# EAGLE design Main circuit SMD (EAGLE 9.4.2)
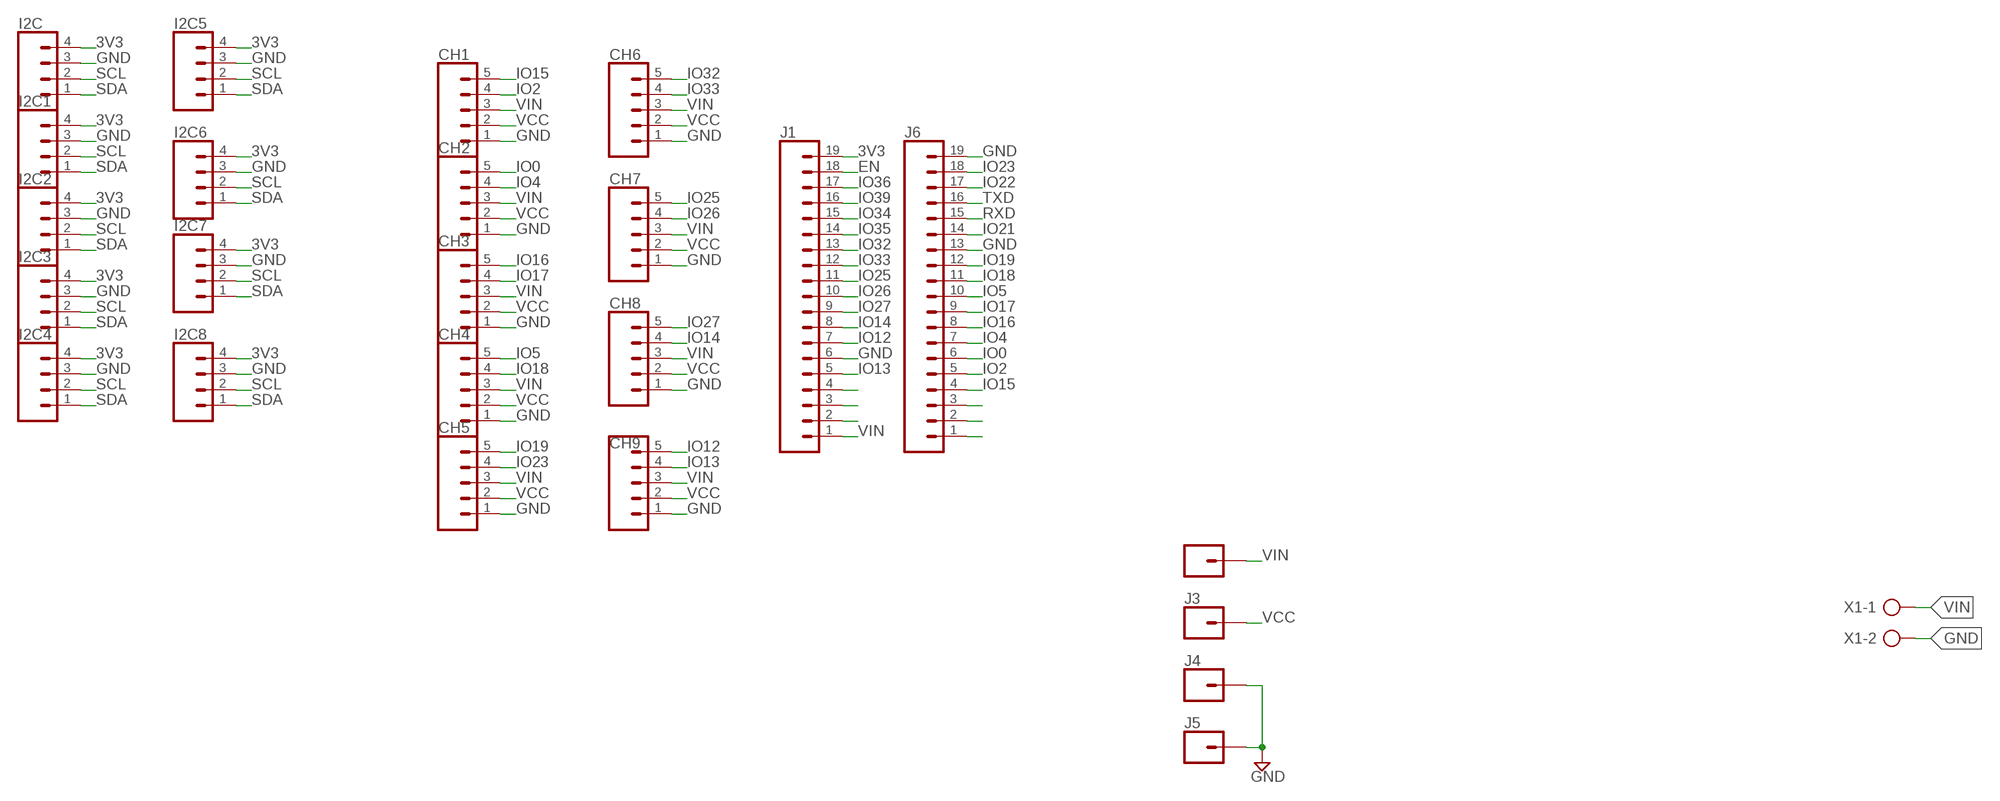
[diagram p0: schematic, sheet 1]

## Parts
CH1  CONN_05  [1X05]
CH2  CONN_05  [1X05]
CH3  CONN_05  [1X05]
CH4  CONN_05  [1X05]
CH5  CONN_05  [1X05]
CH6  CONN_05  [1X05]
CH7  CONN_05  [1X05]
CH8  CONN_05  [1X05]
CH9  CONN_05  [1X05]
I2C  CONN_04  [1X04]
I2C1  CONN_04  [1X04]
I2C2  CONN_04  [1X04]
I2C3  CONN_04  [1X04]
I2C4  CONN_04  [1X04]
I2C5  CONN_04  [1X04]
I2C6  CONN_04  [1X04]
I2C7  CONN_04  [1X04]
I2C8  CONN_04  [1X04]
J1  CONN_19  [1X19]
J2  CONN_01  [1X01]
J3  CONN_01  [1X01]
J4  CONN_01  [1X01]
J5  CONN_01  [1X01]
J6  CONN_19  [1X19]
X1  AK500/2-H  [AK500/2-H]

## Nets
3V3: I2C1.4 I2C2.4 I2C3.4 I2C4.4 I2C5.4 I2C6.4 I2C7.4 I2C8.4 I2C.4 J1.19
EN: J1.18
GND: CH1.1 CH2.1 CH3.1 CH4.1 CH5.1 CH6.1 CH7.1 CH8.1 CH9.1 I2C1.3 I2C2.3 I2C3.3 I2C4.3 I2C5.3 I2C6.3 I2C7.3 I2C8.3 I2C.3 J1.6 J4.1 J5.1 J6.13 J6.19 X1.2
IO0: CH2.5 J6.6
IO2: CH1.4 J6.5
IO4: CH2.4 J6.7
IO5: CH4.5 J6.10
IO12: CH9.5 J1.7
IO13: CH9.4 J1.5
IO14: CH8.4 J1.8
IO15: CH1.5 J6.4
IO16: CH3.5 J6.8
IO17: CH3.4 J6.9
IO18: CH4.4 J6.11
IO19: CH5.5 J6.12
IO21: J6.14
IO22: J6.17
IO23: CH5.4 J6.18
IO25: CH7.5 J1.11
IO26: CH7.4 J1.10
IO27: CH8.5 J1.9
IO32: CH6.5 J1.13
IO33: CH6.4 J1.12
IO34: J1.15
IO35: J1.14
IO36: J1.17
IO39: J1.16
N$18: J1.4
N$19: J1.3
N$20: J1.2
N$22: J6.1
N$23: J6.2
N$24: J6.3
RXD: J6.15
SCL: I2C1.2 I2C2.2 I2C3.2 I2C4.2 I2C5.2 I2C6.2 I2C7.2 I2C8.2 I2C.2
SDA: I2C1.1 I2C2.1 I2C3.1 I2C4.1 I2C5.1 I2C6.1 I2C7.1 I2C8.1 I2C.1
TXD: J6.16
VCC: CH1.2 CH2.2 CH3.2 CH4.2 CH5.2 CH6.2 CH7.2 CH8.2 CH9.2 J3.1
VIN: CH1.3 CH2.3 CH3.3 CH4.3 CH5.3 CH6.3 CH7.3 CH8.3 CH9.3 J1.1 J2.1 X1.1

## Library data of the parts
CH1-CH9 = SparkFun-Connectors:CONN_05: Multi connection point. Often used as Generic Header-pin footprint for 0.1 inch spaced/style header connections On any of the 0.1 inch spaced packages, you can populate with these: Break Away Headers - Straight <https://www.sparkfun.com/products/116> (PRT-00116) Break Away Male Headers - Right Angle <https://www.sparkfun.com/products/553> (PRT-00553) Female Headers <https://www.sparkfun.com/products/115> (PRT-00115) Break Away Headers - Machine Pin <https://www.sparkfun.com/products/117> (PRT-00117) Break Away Female Headers - Swiss Machine Pin <https://www.sparkfun.com/products/743> (PRT-00743) For SCREWTERMINALS and SPRING TERMINALS visit here: Screw Terimnals on SparkFun.com <https://www.sparkfun.com/search/results?term=Screw+Terminals> (5mm/3.5mm/2.54mm spacing) This device is also useful as a general connection point to wire up your design to another part of your project. Our various solder wires solder well into these plated through hole pads. Hook-Up Wire - Assortment (Stranded, 22 AWG) <https://www.sparkfun.com/products/11375> (PRT-11375) Hook-Up Wire - Assortment (Solid Core, 22 AWG) <https://www.sparkfun.com/products/11367> (PRT-11367) View the entire wire category on our website here <https://www.sparkfun.com/categories/141> Special notes: Molex polarized connector foot print use with SKU : PRT-08231 with associated crimp pins and housings. 1MM SMD Version SKU: PRT-10208
I2C I2C1-I2C8 = SparkFun-Connectors:CONN_04: Multi connection point. Often used as Generic Header-pin footprint for 0.1 inch spaced/style header connections On any of the 0.1 inch spaced packages, you can populate with these: Break Away Headers - Straight <https://www.sparkfun.com/products/116> (PRT-00116) Break Away Male Headers - Right Angle <https://www.sparkfun.com/products/553> (PRT-00553) Female Headers <https://www.sparkfun.com/products/115> (PRT-00115) Break Away Headers - Machine Pin <https://www.sparkfun.com/products/117> (PRT-00117) Break Away Female Headers - Swiss Machine Pin <https://www.sparkfun.com/products/743> (PRT-00743) For SCREWTERMINALS and SPRING TERMINALS visit here: Screw Terimnals on SparkFun.com <https://www.sparkfun.com/search/results?term=Screw+Terminals> (5mm/3.5mm/2.54mm spacing) This device is also useful as a general connection point to wire up your design to another part of your project. Our various solder wires solder well into these plated through hole pads. Hook-Up Wire - Assortment (Stranded, 22 AWG) <https://www.sparkfun.com/products/11375> (PRT-11375) Hook-Up Wire - Assortment (Solid Core, 22 AWG) <https://www.sparkfun.com/products/11367> (PRT-11367) View the entire wire category on our website here <https://www.sparkfun.com/categories/141> Special notes: Molex polarized connector foot print use with SKU : PRT-08231 with associated crimp pins and housings. 1MM SMD Version SKU: PRT-10208; PROD_ID: CONN-09696
J1 J6 = SparkFun-Connectors:CONN_19: Multi connection point. Often used as Generic Header-pin footprint for 0.1 inch spaced/style header connections On any of the 0.1 inch spaced packages, you can populate with these: Break Away Headers - Straight <https://www.sparkfun.com/products/116> (PRT-00116) Break Away Male Headers - Right Angle <https://www.sparkfun.com/products/553> (PRT-00553) Female Headers <https://www.sparkfun.com/products/115> (PRT-00115) Break Away Headers - Machine Pin <https://www.sparkfun.com/products/117> (PRT-00117) Break Away Female Headers - Swiss Machine Pin <https://www.sparkfun.com/products/743> (PRT-00743) For SCREWTERMINALS and SPRING TERMINALS visit here: Screw Terimnals on SparkFun.com <https://www.sparkfun.com/search/results?term=Screw+Terminals> (5mm/3.5mm/2.54mm spacing) This device is also useful as a general connection point to wire up your design to another part of your project. Our various solder wires solder well into these plated through hole pads. Hook-Up Wire - Assortment (Stranded, 22 AWG) <https://www.sparkfun.com/products/11375> (PRT-11375) Hook-Up Wire - Assortment (Solid Core, 22 AWG) <https://www.sparkfun.com/products/11367> (PRT-11367) View the entire wire category on our website here <https://www.sparkfun.com/categories/141> Special notes: Molex polarized connector foot print use with SKU : PRT-08231 with associated crimp pins and housings. 1MM SMD Version SKU: PRT-10208 NOTES ON THE VARIANTS LOCK and LOCK_LONGPADS... This footprint was designed to help hold the alignment of a through-hole component (i.e. 6-pin header) while soldering it into place. You may notice that each hole has been shifted either up or down by 0.005 of an inch from it's more standard position (which is a perfectly straight line). This slight alteration caused the pins (the squares in the middle) to touch the edges of the holes. Because they are alternating, it causes a "brace" to hold the component in place. 0.005 has proven to be the perfect amount of "off-center" position when using our standard breakaway headers. Although looks a little odd when you look at the bare footprint, once you have a header in there, the alteration is very hard to notice. Also,if you push a header all the way into place, it is covered up entirely on the bottom side.
J2-J5 = SparkFun-Connectors:CONN_01: Single connection point. Often used as Generic Header-pin footprint for 0.1 inch spaced/style header connections On any of the 0.1 inch spaced packages, you can populate with these: Break Away Headers - Straight <https://www.sparkfun.com/products/116> (PRT-00116) Break Away Male Headers - Right Angle <https://www.sparkfun.com/products/553> (PRT-00553) Female Headers <https://www.sparkfun.com/products/115> (PRT-00115) Break Away Headers - Machine Pin <https://www.sparkfun.com/products/117> (PRT-00117) Break Away Female Headers - Swiss Machine Pin <https://www.sparkfun.com/products/743> (PRT-00743) This device is also useful as a general connection point to wire up your design to another part of your project. Our various solder wires solder well into these plated through hole pads. Hook-Up Wire - Assortment (Stranded, 22 AWG) <https://www.sparkfun.com/products/11375> (PRT-11375) Hook-Up Wire - Assortment (Solid Core, 22 AWG) <https://www.sparkfun.com/products/11367> (PRT-11367) View the entire wire category on our website here <https://www.sparkfun.com/categories/141> Special notes: SMTSO-256-ET is a "flush mount" nut for a 4-40 screw. We mostly use this on specialty testbeds; it is a nice way to connect hardware to your PCB at an adjustable hieght. Also note, the SNAP packages are for using a snappable style connector. We sell a baggie of snaps and they are also used on two LilyPad designs: Snap Assortment - 30 pack (male and female) <https://www.sparkfun.com/products/11347> (DEV-11347) LilyPad Arduino SimpleSnap <https://www.sparkfun.com/products/10941> (DEV-10941) LilyPad SimpleSnap Protoboard <https://www.sparkfun.com/products/10940> (DEV-10940)
X1 = con-ptr500:AK500/2-H: CONNECTOR Aug. 2004 / PTR Meßtechnik: Die Bezeichnung der Serie AK505 wurde geändert. Es handelt sich hierbei um AK500 in horizontaler Ausführung.; OC_FARNELL: unknown; OC_NEWARK: unknown

## Board
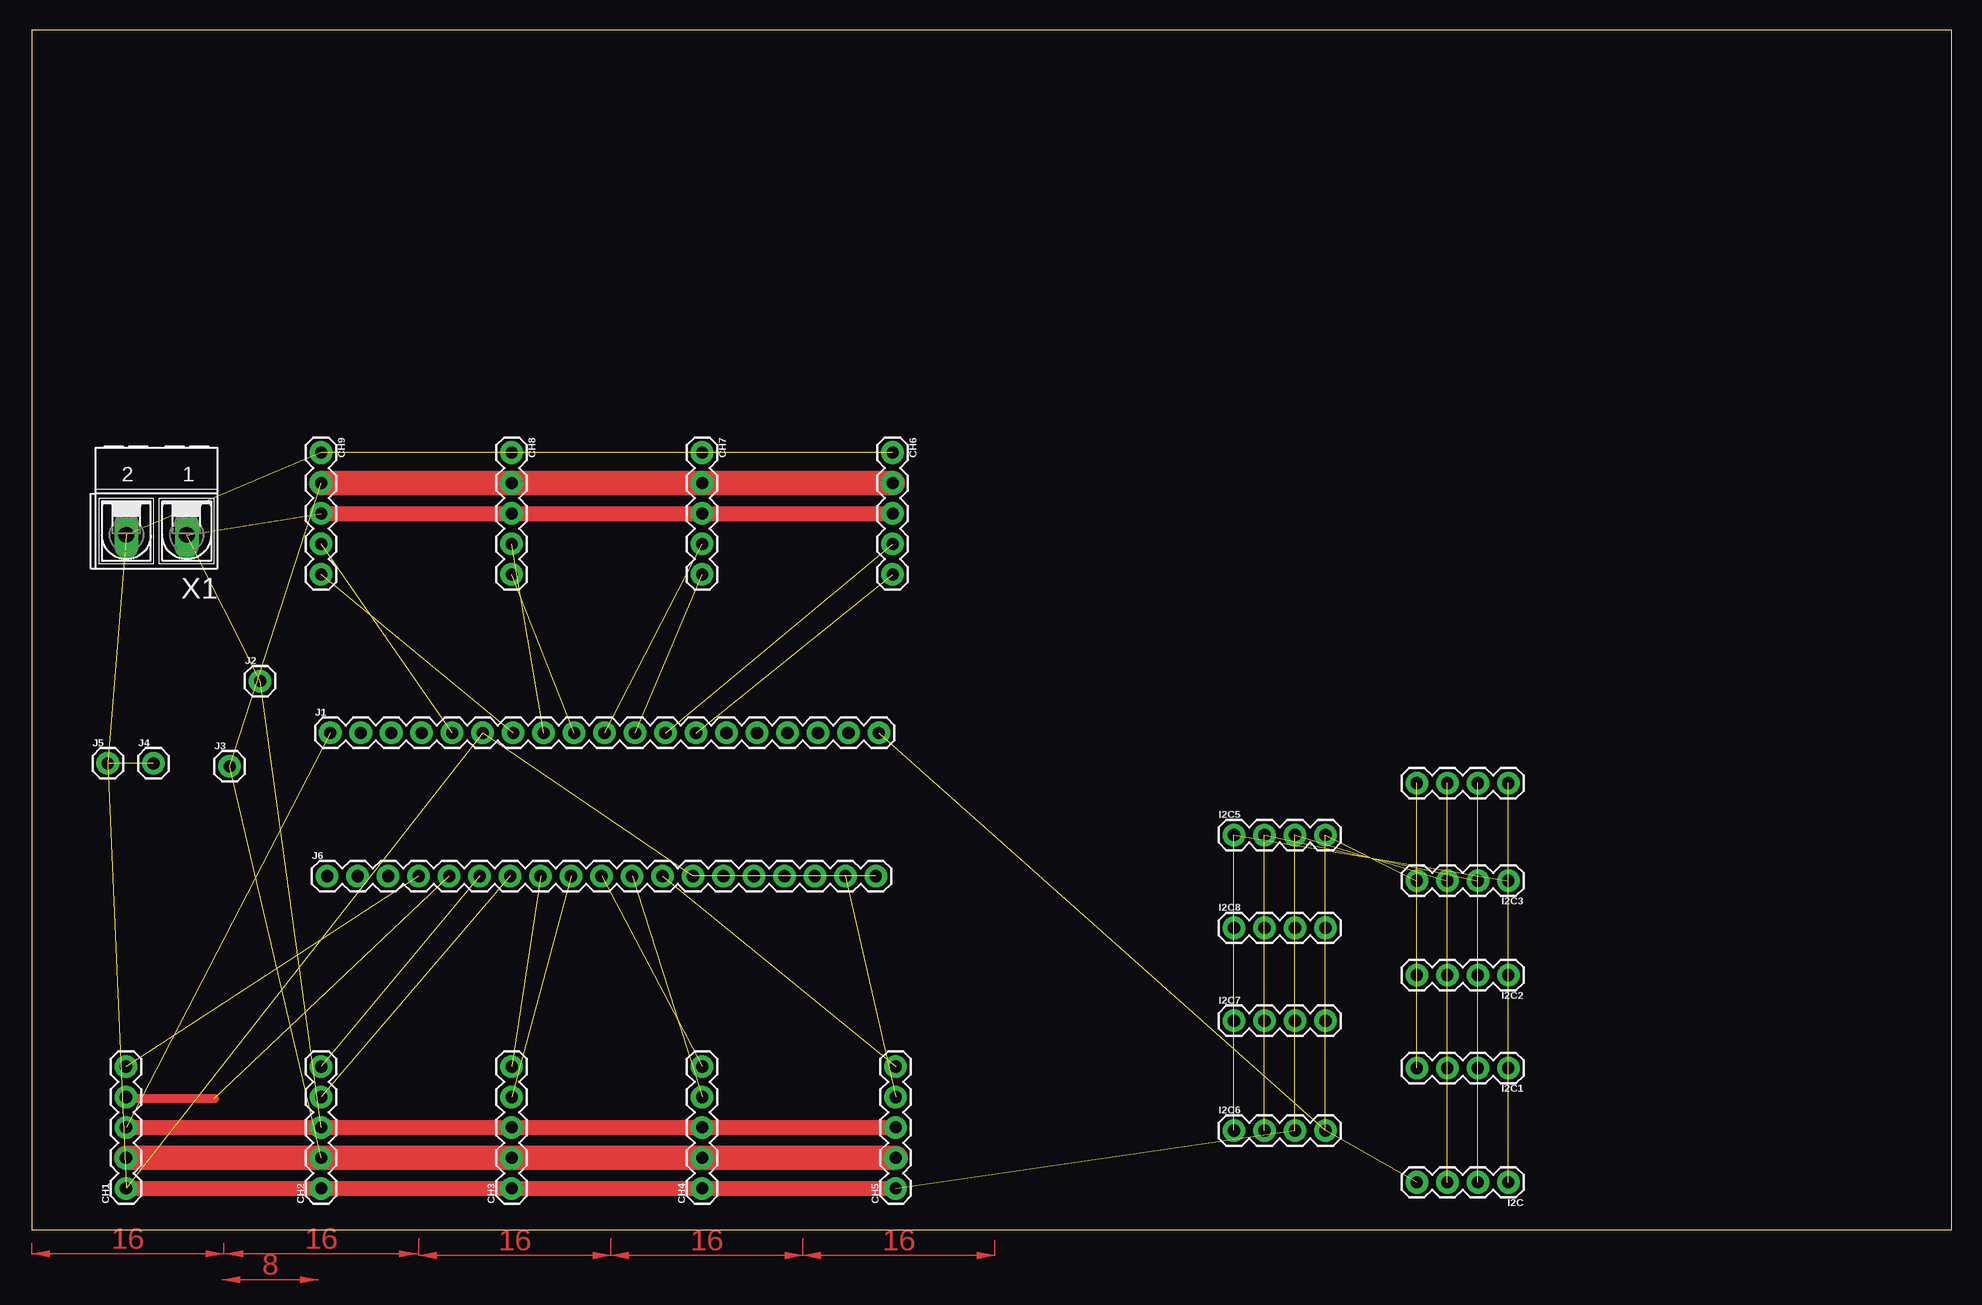
[diagram p1: board, top side]

Size 160 x 100 mm. Coordinates in mm from the lower left corner, seen from the top.
Outline: 0,0 160,0 160,100 0,100 0,0
Copper layers (1*16): Top 0.035mm / dielectric 1.5mm / Bottom 0.035mm
Design rules "default": minimum track width 6mil, minimum drill 0.35mm, track to track 6mil, track to pad 6mil, pad to pad 6mil, via to via 6mil, smd to smd 6mil, copper to edge 40mil, drill to drill 6mil, minimum pad ring 10mil, minimum via ring 8mil, stop-mask expansion 4mil, vias tented up to drill 0mil, thermal gap 10mil

### Footprints (pad centres in the part's own frame; a part is rotated, then mirrored left to right if it is on the bottom)
1X05 = drill 1.016 pad 1.88: 1 0,0; 2 2.54,0; 3 5.08,0; 4 7.62,0; 5 10.16,0
1X04 = drill 1.016 pad 1.88: 1 0,0; 2 2.54,0; 3 5.08,0; 4 7.62,0
1X19 = drill 1.016 pad 1.88: 1 0,0; 2 2.54,0; 3 5.08,0; 4 7.62,0; 5 10.16,0; 6 12.7,0; 7 15.24,0; 8 17.78,0; 9 20.32,0; 10 22.86,0; 11 25.4,0; 12 27.94,0; 13 30.48,0; 14 33.02,0; 15 35.56,0; 16 38.1,0; 17 40.64,0; 18 43.18,0; 19 45.72,0
1X01 = drill 1.016 pad 1.88: 1 0,0
AK500/2-H = drill 1.321 long: 1 -2.515,0; 2 2.515,0

### Placement (x,y rotation side)
CH1  7.87,3.43 90 top
CH2  24.13,3.43 90 top
CH3  40.01,3.43 90 top
CH4  55.88,3.43 90 top
CH5  72.01,3.43 90 top
CH6  71.75,64.77 270 top
CH7  55.88,64.77 270 top
CH8  40.01,64.77 270 top
CH9  24.13,64.77 270 top
I2C  123.06,3.94 180 top
I2C1  123.06,13.46 180 top
I2C2  123.06,21.21 180 top
I2C3  123.06,29.08 180 top
I2C4  123.06,37.21 180 top
I2C5  100.2,32.89 0 top
I2C6  100.2,8.26 0 top
I2C7  100.2,17.4 0 top
I2C8  100.2,25.15 0 top
J1  24.89,41.4 0 top
J2  19.05,45.72 0 top
J3  16.51,38.61 0 top
J4  10.16,38.86 0 top
J5  6.35,38.86 0 top
J6  24.64,29.46 0 top
X1  10.41,57.91 180 top

### Tracks (layer width: path | path; a pad name or v marks a point on that pad's centre or on a via)
3V3  (9 unrouted)
GND  (19 unrouted)
  Top 1.27: CH1.1 CH2.1 CH3.1 CH4.1 CH5.1
IO0  (1 unrouted)
IO2  (1 unrouted)
  Top 0.762: 15.24,10.92 8,10.92 CH1.4
IO4  (1 unrouted)
IO5  (1 unrouted)
IO12  (1 unrouted)
IO13  (1 unrouted)
IO14  (1 unrouted)
IO15  (1 unrouted)
IO16  (1 unrouted)
IO17  (1 unrouted)
IO18  (1 unrouted)
IO19  (1 unrouted)
IO23  (1 unrouted)
IO25  (1 unrouted)
IO26  (1 unrouted)
IO27  (1 unrouted)
IO32  (1 unrouted)
IO33  (1 unrouted)
SCL  (8 unrouted)
SDA  (8 unrouted)
VCC  (2 unrouted)
  Top 2.032: CH1.2 CH2.2 CH3.2 CH4.2 CH5.2 | CH9.2 CH8.2 CH7.2 CH6.2
VIN  (4 unrouted)
  Top 1.27: CH1.3 CH2.3 CH3.3 CH4.3 CH5.3 | CH9.3 CH8.3 CH7.3 CH6.3
(copper drawn outside any net)
  shapes: Top area x6